# Altium project StepperController.PrjPcb
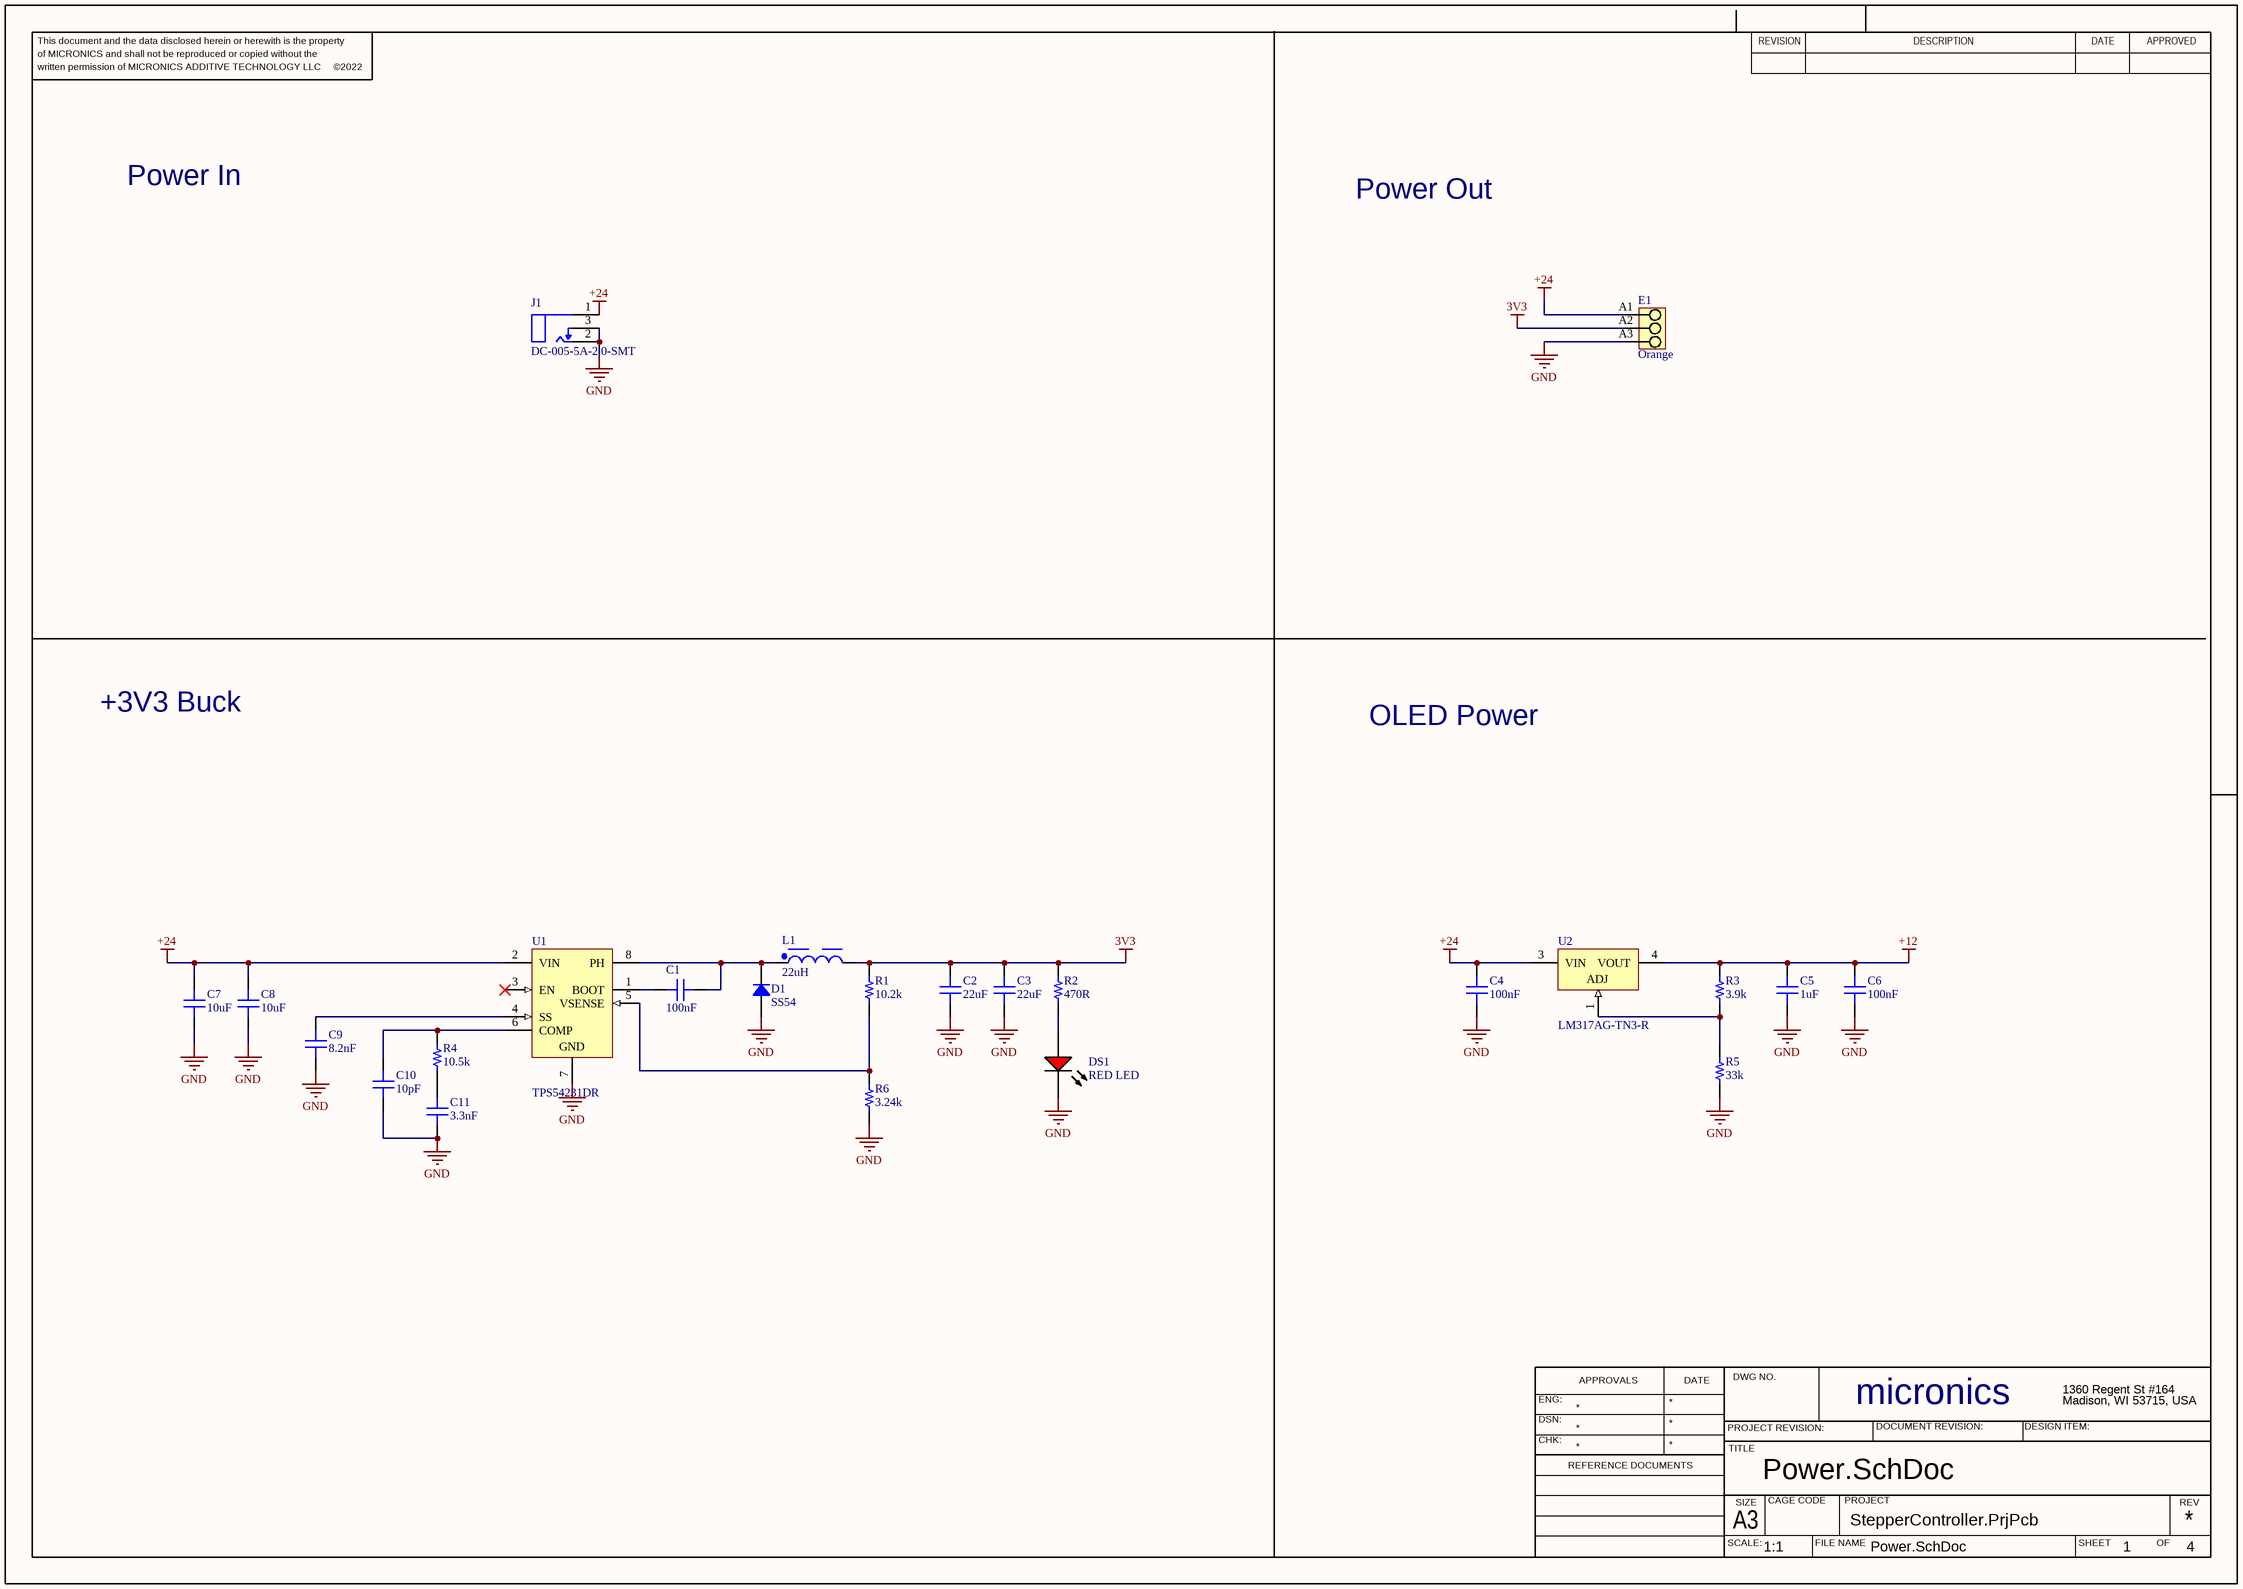
[diagram p0: Power.SchDoc]
4 sheets, 108 parts. Net scope: flat (ports and power ports of the same name join across sheets).
Board file: StepperController_PCB.PcbDoc
Sheets:
  Power.SchDoc
  ESP32.SchDoc
  Stepper.SchDoc
  Buttons.SchDoc

## Sheet Power.SchDoc
size 420 x 297 mm; SheetNumber: 1; SheetTotal: 4

### Parts
C1  100nF  [CAP 0603_1608]
C2  22uF  [CAP 1206_3216 - 0.8MM]
C3  22uF  [CAP 1206_3216 - 0.8MM]
C4  100nF  [CAP 0603_1608]
C5  1uF  [CAP 0603_1608]
C6  100nF  [CAP 0603_1608]
C7  10uF  [CAP 1206_3216 - 0.8MM]
C8  10uF  [CAP 1206_3216 - 0.8MM]
C9  8.2nF  [CAP 0603_1608]
C10  10pF  [CAP 0603_1608]
C11  3.3nF  [CAP 0603_1608]
D1  SS54  [DO214AC SMA]
DS1  RED LED  [VISH-TLMS1000_V]
E1  Orange  [PM_5_08_90_03]
J1  DC-005-5A-2.0-SMT  [FP-PJ-002BH-SMT-TR-MFG]
L1  22uH  [WE-PD_1050P]
R1  10.2k  [RES 0603_1608]
R2  470R  [RES 0603_1608]
R3  3.9k  [RES 0603_1608]
R4  10.5k  [RES 0603_1608]
R5  33k  [RES 0603_1608]
R6  3.24k  [RES 0603_1608]
U1  TPS54231DR  [D0008A_L]
U2  LM317AG-TN3-R  [TO-252_L]

### Nets
3V3: C2.2 C3.2 E1.A2 L1.2 R1.2 R2.2
+12: C5.1 C6.1 R3.2 U2.4(VOUT)
+24: C4.1 C7.2 C8.2 E1.A1 J1.1 U1.2(VIN) U2.3(VIN)
GND: C2.1 C3.1 C4.2 C5.2 C6.2 C7.1 C8.1 C9.1 C10.1 C11.1 D1.1 DS1.2(K) E1.A3 J1.2 J1.3 R5.1 R6.1 U1.7(GND)
NetC1_1: C1.1 D1.2 L1.1 U1.8(PH)
NetC1_2: C1.2 U1.1(BOOT)
NetC9_2: C9.2 U1.4(SS)
NetC10_2: C10.2 R4.2 U1.6(COMP)
NetC11_2: C11.2 R4.1
NetDS1_1: DS1.1(A) R2.1
NetR1_1: R1.1 R6.2 U1.5(VSENSE)
NetR3_1: R3.1 R5.2 U2.1(ADJ)

Not connected (* = marked no-connect by the designer): U1 3(EN)*

### Notes on the sheet
- Power In
- Power Out
- +3V3 Buck
- OLED Power
- This document and the data disclosed herein or herewith is the property
- of MICRONICS and shall not be reproduced or copied without the
- REVISION
- DESCRIPTION
- DATE
- APPROVED
- written permission of MICRONICS ADDITIVE TECHNOLOGY LLC     ©2022
- ENG:
- APPROVALS
- DWG NO.
- micronics
- 1360 Regent St #164
- Madison, WI 53715, USA
- DSN:
- CHK:
- REFERENCE DOCUMENTS
- PROJECT REVISION:
- TITLE
- DOCUMENT REVISION:
- DESIGN ITEM:
- SCALE:
- A3
- SIZE
- CAGE CODE
- FILE NAME
- PROJECT
- SHEET
- OF
- REV
- 1:1

### Library data of the parts
C1 = 250X14W223MV4T: C14663; manufacturer: Johanson Dielectrics Inc.; Temperature Coefficient: X7R; Tolerance: ±20%; Voltage - Rated: 25V; Part Number: 250X14W223MV4T; Value: 100nF; Applications: Bypass, Decoupling; Capacitance: 100nF; componentlink1description: Datasheet; componentlink1url: https://www.johansondielectrics.com/downloads/x2y-filter-and-decoupling-capacitors.pdf; componentlink2description: DigiKey Link; componentlink2url: https://www.digikey.com/en/products/detail/johanson-dielectrics-inc/250X14W223MV4T/1628740; Device Package: 0603 (1608 Metric); Features: Low ESL (X2Y); lastupdated: 2022-05-16 11:25:57 AM; Lifecycle Status: Active; Minimum Order: 1; Mounting Type: Surface Mount, MLCC; Operating Temperature: -55°C ~ 125°C; Package / Case: 0603 (1608 Metric); packaging: TapeAndReel; partid: 14325; Part Status: Active; price: 0.07; series: X2Y®; Size / Dimension: 0.064" L x 0.035" W (1.63mm x 0.89mm); Supplier 1: DigiKey; Supplier Part Number 1: 709-1087-1-ND; Thickness (Max): 0.026" (0.66mm)
C2 C3 = MM061A101JCT2A: C12891; manufacturer: AVX Corporation; Temperature Coefficient: C0G, NP0; Tolerance: ±5%; Voltage - Rated: 100V; Part Number: MM061A101JCT2A; Value: 22uF; Applications: Medical, Non-Critical; Capacitance: 22uF; componentlink1description: Datasheet; componentlink1url: http://datasheets.avx.com/AVX-MM.pdf; componentlink2description: DigiKey Link; componentlink2url: http://digikey.com/product-detail/en/avx-corporation/MM061A101JCT2A/478-10622-1-ND/7344883; Device Package: 1206 (3216 Metric); lastupdated: 2020-09-02 1:04:46 AM; Lifecycle Status: Active; Minimum Order: 1; Mounting Type: Surface Mount, MLCC; Operating Temperature: -55°C ~ 125°C; Package / Case: 1206 (3216 Metric); packaging: TapeAndReel; partid: 18685; Part Status: Active; price: 0.52; series: MM; Size / Dimension: 0.126" L x 0.063" W (3.20mm x 1.60mm); Supplier 1: DigiKey; Supplier Part Number 1: 478-10622-1-ND; Thickness (Max): 0.029" (0.74mm)
C4-C6 = 250X14W223MV4T: CAP CER 0.022UF 25V X7R 0603; manufacturer: Johanson Dielectrics Inc.; Tolerance: ±20%; Part Number: 250X14W223MV4T; Applications: Bypass, Decoupling; componentlink1description: Datasheet; componentlink1url: https://www.johansondielectrics.com/downloads/x2y-filter-and-decoupling-capacitors.pdf; componentlink2description: DigiKey Link; componentlink2url: https://www.digikey.com/en/products/detail/johanson-dielectrics-inc/250X14W223MV4T/1628740; Device Package: 0603 (1608 Metric); Features: Low ESL (X2Y); lastupdated: 2022-05-20 2:39:33 PM; Lifecycle Status: Active; Minimum Order: 1; Mounting Type: Surface Mount, MLCC; Operating Temperature: -55°C ~ 125°C; Package / Case: 0603 (1608 Metric); packaging: TapeAndReel; partid: 14325; Part Status: Active; price: 0.07; series: X2Y®; Size / Dimension: 0.064" L x 0.035" W (1.63mm x 0.89mm); Supplier 1: DigiKey; Supplier Part Number 1: 709-1087-1-ND; Temperature Coefficient: X7R; Thickness (Max): 0.026" (0.66mm); Voltage - Rated: 25V
  C4 C6: Value: 100nF; Capacitance: 100nF
  C5: Value: 1uF; Capacitance: 1uF
C7 C8 = MM061A101JCT2A: C13585; manufacturer: AVX Corporation; Temperature Coefficient: C0G, NP0; Tolerance: ±5%; Voltage - Rated: 100V; Part Number: MM061A101JCT2A; Value: 10uF; Applications: Medical, Non-Critical; Capacitance: 10uF; componentlink1description: Datasheet; componentlink1url: http://datasheets.avx.com/AVX-MM.pdf; componentlink2description: DigiKey Link; componentlink2url: http://digikey.com/product-detail/en/avx-corporation/MM061A101JCT2A/478-10622-1-ND/7344883; Device Package: 1206 (3216 Metric); lastupdated: 2020-09-02 1:04:46 AM; Lifecycle Status: Active; Minimum Order: 1; Mounting Type: Surface Mount, MLCC; Operating Temperature: -55°C ~ 125°C; Package / Case: 1206 (3216 Metric); packaging: TapeAndReel; partid: 18685; Part Status: Active; price: 0.52; series: MM; Size / Dimension: 0.126" L x 0.063" W (3.20mm x 1.60mm); Supplier 1: DigiKey; Supplier Part Number 1: 478-10622-1-ND; Thickness (Max): 0.029" (0.74mm)
C9-C11 = 250X14W223MV4T: manufacturer: Johanson Dielectrics Inc.; Temperature Coefficient: X7R; Tolerance: ±20%; Voltage - Rated: 25V; Part Number: 250X14W223MV4T; Applications: Bypass, Decoupling; componentlink1description: Datasheet; componentlink1url: https://www.johansondielectrics.com/downloads/x2y-filter-and-decoupling-capacitors.pdf; componentlink2description: DigiKey Link; componentlink2url: https://www.digikey.com/en/products/detail/johanson-dielectrics-inc/250X14W223MV4T/1628740; Device Package: 0603 (1608 Metric); Features: Low ESL (X2Y); lastupdated: 2022-05-16 11:25:57 AM; Lifecycle Status: Active; Minimum Order: 1; Mounting Type: Surface Mount, MLCC; Operating Temperature: -55°C ~ 125°C; Package / Case: 0603 (1608 Metric); packaging: TapeAndReel; partid: 14325; Part Status: Active; price: 0.07; series: X2Y®; Size / Dimension: 0.064" L x 0.035" W (1.63mm x 0.89mm); Supplier 1: DigiKey; Supplier Part Number 1: 709-1087-1-ND; Thickness (Max): 0.026" (0.66mm)
  C9: Value: 8.2nF; Capacitance: 8.2nF
  C10: Value: 10pF; Capacitance: 10pF
  C11: Value: 3.3nF; Capacitance: 3.3nF
D1 = RS1A: Manufacturer: ON Semiconductor; Capacitance @ Vr, F: 10pF @ 4V, 1MHz; Current - Average Rectified (Io): 1A; Current - Reverse Leakage @ Vr: 5µA @ 50V; Diode Type: Standard; Reverse Recovery Time (trr): 150ns; Speed: Fast Recovery =< 500ns, > 200mA (Io); Voltage - DC Reverse (Vr) (Max): 50V; Voltage - Forward (Vf) (Max) @ If: 1.3V @ 1A; Part Number: SS54; ComponentLink1Description: Datasheet; ComponentLink1URL: https://www.onsemi.com/pub/Collateral/RS1M-D.PDF; ComponentLink2Description: DigiKey Link; ComponentLink2URL: http://digikey.com/product-detail/en/on-semiconductor/RS1A/RS1ACT-ND/3504478; LastUpdated: 2022-05-20 3:23:52 PM; Lifecycle Status: Active; Minimum Order: 1; Mounting Type: Surface Mount; Operating Temperature - Junction: -55°C ~ 150°C; Package / Case: DO-214AC, SMA; Packaging: TapeAndReel; PartId: 585; Part Status: Active; Price: 0.08; Series: -; Supplier 1: DigiKey; Supplier Part Number 1: RS1ACT-ND; Supplier Device Package: SMA (DO-214AC)
DS1 = CMP-2000-07254-1: 0603 LED; Manufacturer: Vishay; Lens Shape: Rectangular; LED Mounting: SMD; Automotive Qualification Standard: AEC-Q100; Wavelength Typ: 636nm; SVHC: ToBeAdvised; Bulb Size: 1.6mmx0.8mm; Forward Voltage: 1.8V; Luminous Intensity: 4mcd; Forward Current If: 2mA; Viewing Angle: 80°; Datasheet Version: Rev. 1.7, 02/2011; Datasheet URL: https://datasheet.ciiva.com/5798/1698881-5798337.pdf; Packaging: CutTape; Package Reference: TLMS1000; Manufacturer URL: http://www.vishay.com/; Mounting Technology: SurfaceMount; Product Range: -; LED Colour: Red; Package Description: 2-Pin Surface Mount Device, Body 1.6 x 0.8 mm; MSL: MSL2-1year
E1 = CMP-1559-01629-1: C430604; PartNumber: 1760500000; Manufacturer: Weidmueller; Pitch_mm: 5,08 mm; Pitch_inch: 0,2 inch; Wire_cross_section_AWG_min_UL_1059: AWG 26; Contact_surface: tinned; Contact_material: Cu-Leg; Short_text_for_material: PM 5.08/03/90 3.5SN OR BX; Rated_voltage_use_group_B_UL_1059: 300 V; Solid_min_H05_07_V_U: 0,13 mm²; Solder_pin_length_mm: 3,5 mm; Rated_voltage_for_surge_voltage_class_pollution_degree_II_2: 600 V; Mounting_onto_the_PCB: Solder connection; Solid_max_H05_07_V_U: 2,5 mm²; Side_termination_characteristic: closed side; Rated_current_use_group_B_UL_1059: 15 A; Wire_cross_section_AWG_max_UL_1059: AWG 14; Insulating_material: Wemid (PA); UL_94_flammability_rating: V-0; No_of_poles: 3; ComponentLink2Description: URL Link1; ComponentLink1Description: Manufacturer URL; ComponentLink2URL: http://catalog.weidmueller.com/catalog/Start.do?localeId=en&ObjectID=1760500000; ComponentLink1URL: http://www.weidmueller.com/; Qty: 500 PCS; Colour: Orange; Packaging: Box; Revision: V1; PackageReference: PM_5_08_90_03
J1 = CMP-2000-06897-2: C319134; Manufacturer: CUI Inc; Manufacturer Part Number: PJ-002BH-SMT-TR; Current Rating: 5A; Standoff Height: 0.1mm; Voltage Rating: 24V; Conn Gender: Male; Conn Orientation: Right Angle; Number Of Contacts: 3; Temperature Range Low: -25°C; Category: Conn; Package: 0; Device Class L2: Power Connectors; Contact Material: Nickel,Silver; Automotive: No; Mouser Description: 2.5 mm Center Pin, 5.0 A, Right Angle, Surface Mount (SMT), Dc Power Jack Connector; Device Class L3: unset; ComponentLink2URL: https://www.cuidevices.com/product/resource/digikeypdf/pj-002bh-smt-tr.pdf; Octopart: https://octopart.com/pj-002bh-smt-tr-cui-25947151; Lead Free: Yes; ComponentLink2Description: Datasheet; Digikey Description: CONN PWR JACK 2.5X5.5MM SOLDER; Height: 11.43mm; Temperature: -25°C to +85°C; RoHS: TRUE; Device Class L1: Connectors; Temperature Range High: +85°C
L1 = CMP-1396-00034-2: C2651173; NexarPartId: 22866943; Test Frequency: 100kHz; Inductance Tolerance: 20%; Inductance: 22µH; Core Material: Ferrite; Resistance: 50mΩ; DC Resistance (DCR): 42mΩ; Self Resonant Frequency: 14.5MHz; Max DC Current: 3A; Shielding: Shielded; Saturation Current: 3.6A; Min Operating Temperature: -40°C; Max Operating Temperature: 150°C; Case/Package: Nonstandard; Length: 10mm; Width: 10mm; Termination: SMD/SMT; Series Resistance: 50mΩ; Height: 5mm; Ambient Temperature Range Low: -40°C; RMS Current (Irms): 3A; Composition: Wirewound; Tolerance: 20%; REACH SVHC: Unknown; Depth: 10mm; Packaging: Tape & Reel (TR); Mount: Surface Mount; Height - Seated (Max): 5.0038mm; RoHS: Compliant; Number of Pins: 2; Ambient Temperature Range High: 110°C; Current Rating: 3A
R1-R6 = RNCF0603DTE23K2: RES 23.2K OHM 0.5% 1/10W 0603; Manufacturer: Stackpole Electronics Inc; Power (Watts): 0.1W, 1/10W; Temperature Coefficient: ±25ppm/°C; Part Number: RNCF0603DTE23K2; ComponentLink1Description: Datasheet; ComponentLink1URL: https://www.seielect.com/catalog/sei-rncf.pdf; ComponentLink2Description: DigiKey Link; ComponentLink2URL: https://www.digikey.com/en/products/detail/stackpole-electronics-inc/RNCF0603DTE23K2/6264115; Composition: Thin Film; Device Package: 0603 (1608 Metric); Features: Automotive AEC-Q200; Height - Seated (Max): 0.022" (0.55mm); LastUpdated: 2022-05-20 3:01:33 PM; Lifecycle Status: Active; Minimum Order: 1; Number of Terminations: 2; Operating Temperature: -55°C ~ 155°C; Package / Case: 0603 (1608 Metric); Packaging: TapeAndReel; PartId: 5426; Part Status: Active; Price: 0.01; Ratings: AEC-Q200; Series: RNCF; Size / Dimension: 0.061" L x 0.031" W (1.55mm x 0.80mm); Supplier 1: DigiKey; Supplier Part Number 1: RNCF0603DTE23K2CT-ND; Supplier Device Package: 0603; Tolerance: ±0.5%
  R1: Value: 10.2k; Resistance: 10.2k
  R2: Value: 470R; Resistance: 470R
  R3: Value: 3.9k; Resistance: 3.9k
  R4: Value: 10.5k; Resistance: 10.5k
  R5: Value: 33k; Resistance: 33k
  R6: Value: 3.24k; Resistance: 3.24k
U1 = CMP-0323-00207-3: Buck Step Down Regulator with 3.5 to 28 V Input and 0.8 to 25 V Output, -40 to 150 degC, 8-Pin SOIC (D), Green (RoHS & no Sb/Br); Manufacturer: Texas Instruments; Vout(Min)(V): 0.8; Iout(Max)(A): 2; SubFamily: Step-Down Regulator; Vin(Min)(V): 3.5; Rating: Catalog; Duty Cycle(Max)(%): 90; Switch Current Limit(Typ)(A): 2.3; Iq(Typ)(mA): 0.11; Regulated Outputs(#): 1; Vout(Max)(V): 25; Vin(Max)(V): 28; ComponentLink2Description: Package Specification; PackageVersion: revM, Jun-2011; Topology: Buck; PackageReference: D0008A; DatasheetVersion: SLUS851C; Code_JEDEC: MS-012AA; PartNumber: TPS54231DR; ComponentLink2URL: http://www.ti.com/litv/pdf/msoi002j; Eco-Plan: Green (RoHS & no Sb/Br); ComponentLink1URL: http://www.ti.com/general/docs/lit/getliterature.tsp?genericPartNumber=TPS54231&fileType=pdf; ComponentLink1Description: Datasheet; PackageDescription: 8-Pin Plastic Small Outline Integrated Circuit, 4.9 x 3.9 mm, Pitch 1.27 mm Pitch; ComponentLink3URL: Samples URL:http://www.ti.com/product/tps54231#samples; Mounting Technology: Surface Mount; ComponentLink3Description: URL Link1
U2 = CMP-0244-00074-1: C75510; DatasheetVersion: 1/02/2008; ComponentLink1Description: Manufacturer URL; PackageReference: TO-252; ComponentLink2Description: Datasheet; PackageDescription: 3-Pin Transistor Outline Package 2.28 mm Pitch, 9.7 mm Lead Span (DPAK); ComponentLink2URL: http://www.st.com/internet/com/TECHNICAL_RESOURCES/TECHNICAL_LITERATURE/DATASHEET/CD00000549.pdf; PackageVersion: 2011; ComponentLink1URL: http://www.st.com

## Sheet ESP32.SchDoc
size 420 x 297 mm; SheetNumber: 2; SheetTotal: 4
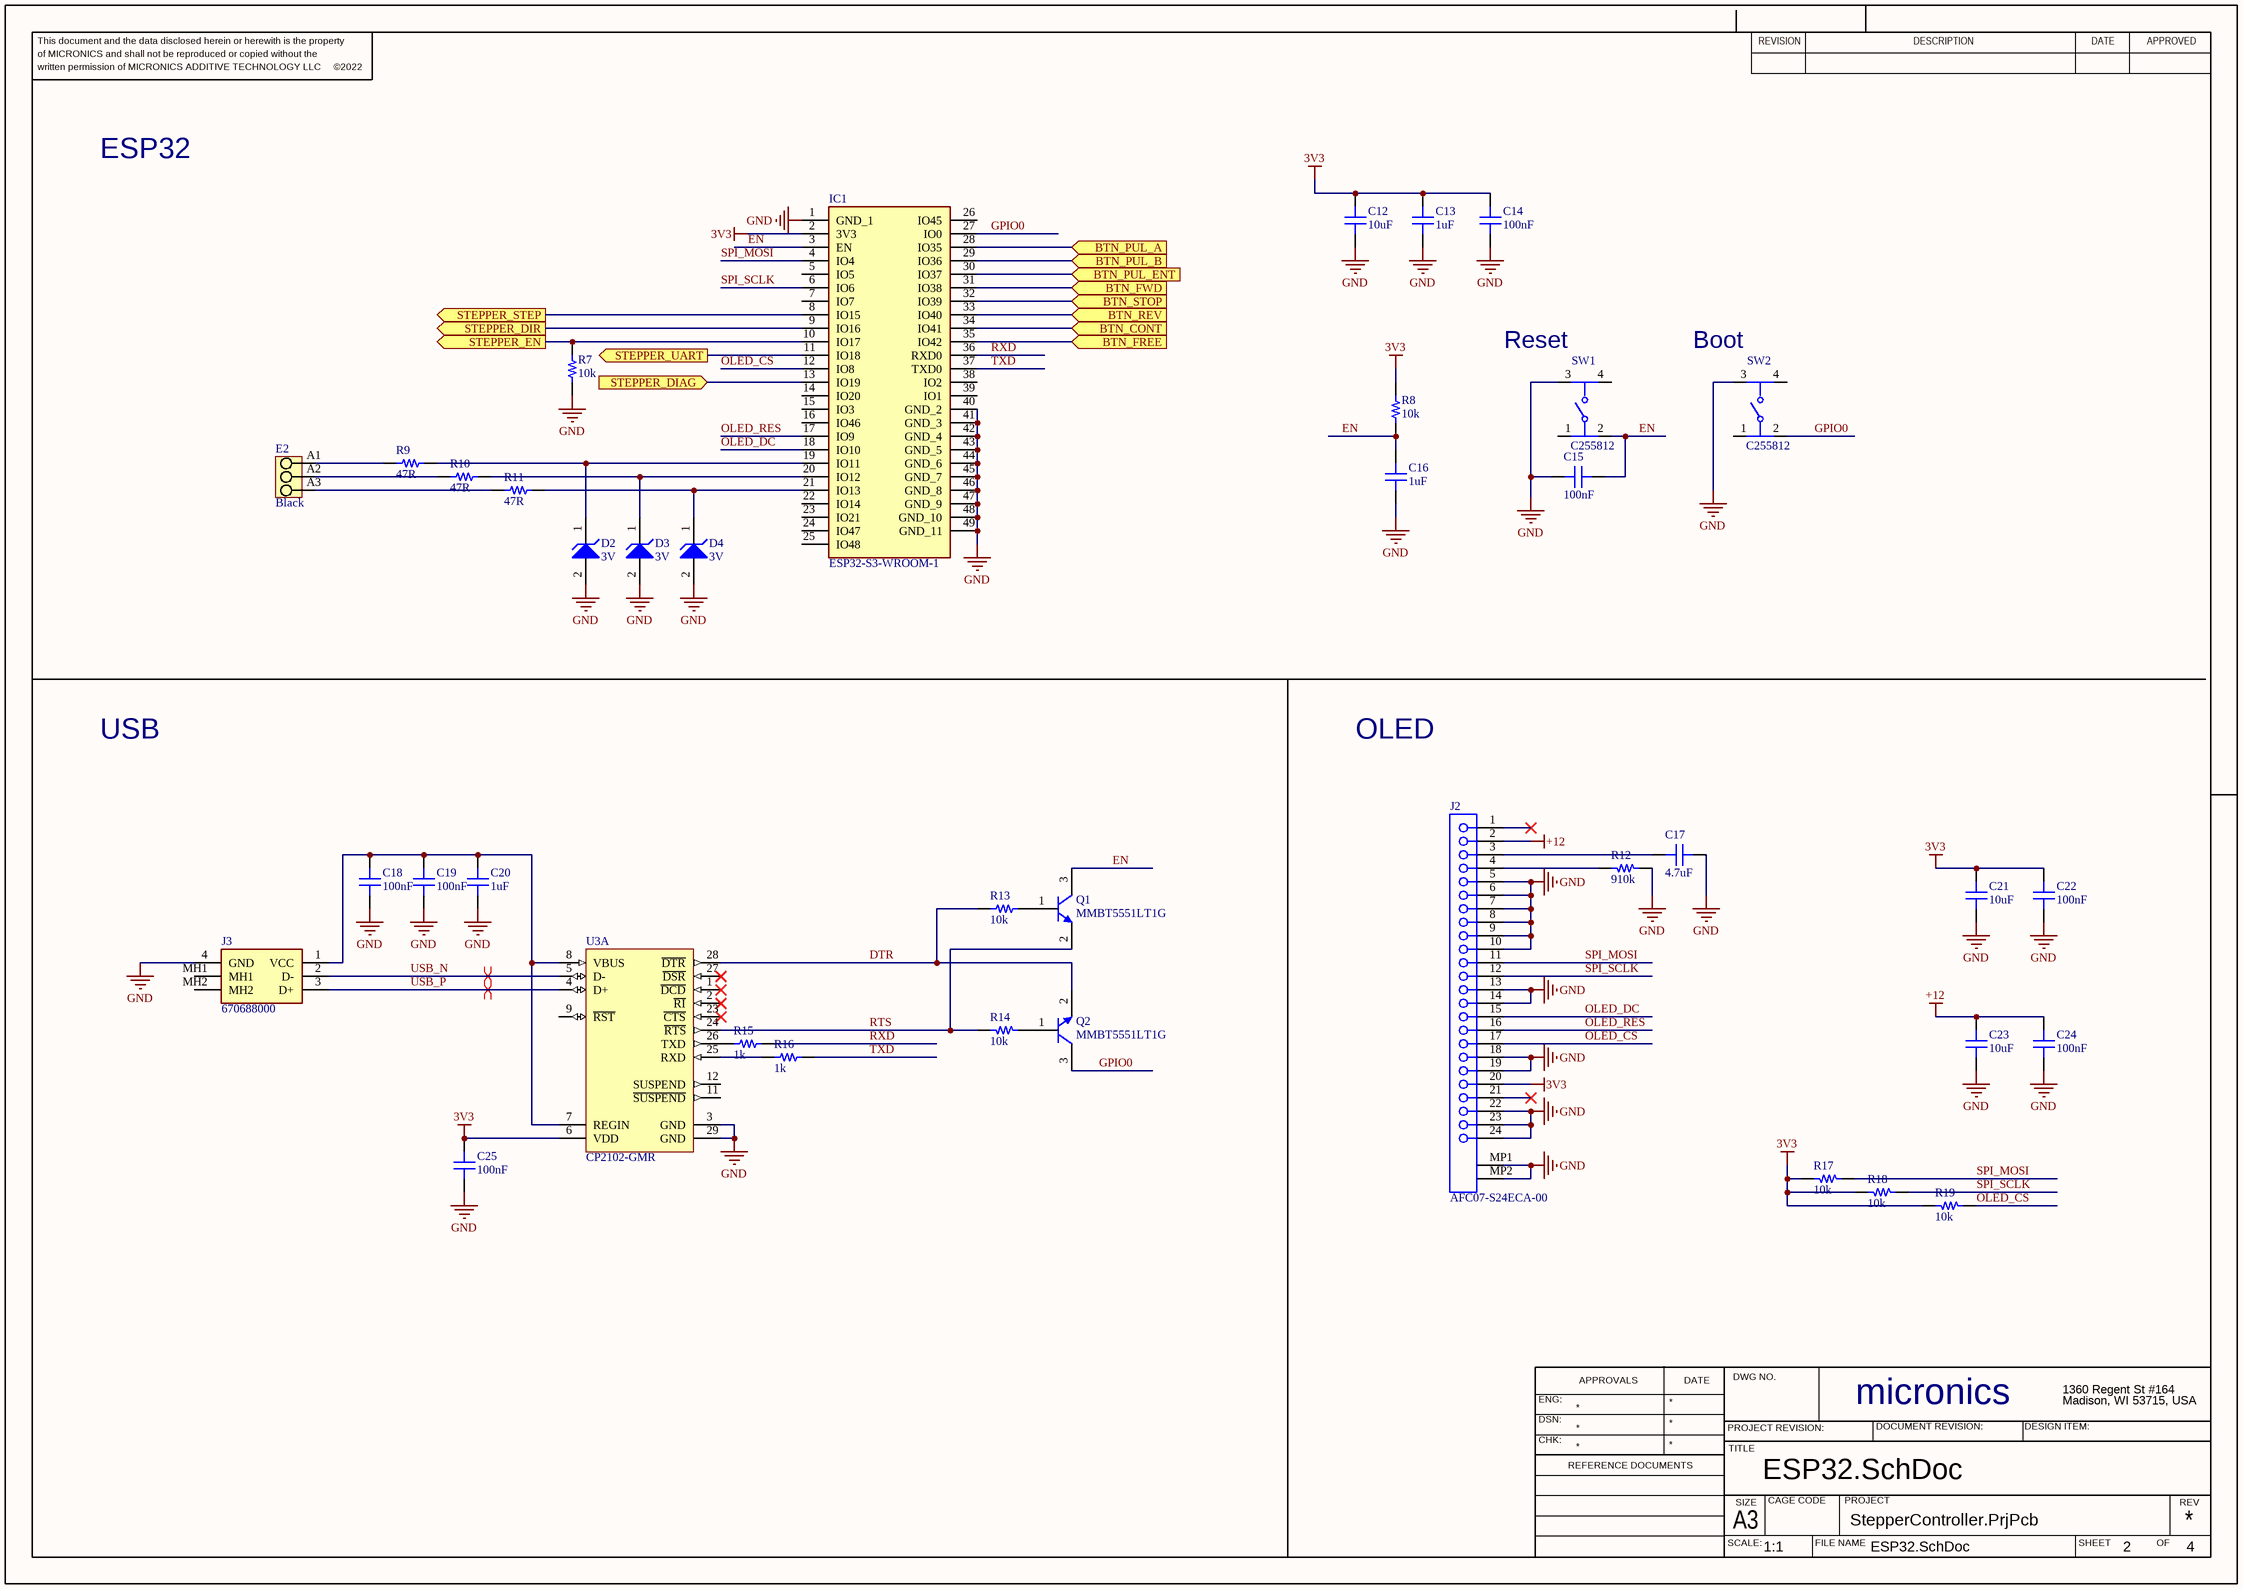
[diagram p1: ESP32.SchDoc]

### Parts
C12  10uF  [CAP 1206_3216 - 0.8MM]
C13  1uF  [CAP 0603_1608]
C14  100nF  [CAP 0603_1608]
C15  100nF  [CAP 0603_1608]
C16  1uF  [CAP 0603_1608]
C17  4.7uF  [CAP 1206_3216 - 0.8MM]
C18  100nF  [CAP 0603_1608]
C19  100nF  [CAP 0603_1608]
C20  1uF  [CAP 0603_1608]
C21  10uF  [CAP 1206_3216 - 0.8MM]
C22  100nF  [CAP 0603_1608]
C23  10uF  [CAP 1206_3216 - 0.8MM]
C24  100nF  [CAP 0603_1608]
C25  100nF  [CAP 0603_1608]
D2  3V  [ONSC-SOD-123-2-425-04_V]
D3  3V  [ONSC-SOD-123-2-425-04_V]
D4  3V  [ONSC-SOD-123-2-425-04_V]
E2  Black  [PM_5_08_90_03]
IC1  ESP32-S3-WROOM-1  [ESP32S3WROOM1]
J2  AFC07-S24ECA-00  [MOLX-52437-2471]
J3  670688000  [670688000]
Q1  MMBT5551LT1G  [ONSC-SOT-23-3-318-08_V]
Q2  MMBT5551LT1G  [ONSC-SOT-23-3-318-08_V]
R7  10k  [RES 0603_1608]
R8  10k  [RES 0603_1608]
R9  47R  [RES 0603_1608]
R10  47R  [RES 0603_1608]
R11  47R  [RES 0603_1608]
R12  910k  [RES 0603_1608]
R13  10k  [RES 0603_1608]
R14  10k  [RES 0603_1608]
R15  1k  [RES 0603_1608]
R16  1k  [RES 0603_1608]
R17  10k  [RES 0603_1608]
R18  10k  [RES 0603_1608]
R19  10k  [RES 0603_1608]
SW1  C255812  [FP-FSM2JSMAA-MFG]
SW2  C255812  [FP-FSM2JSMAA-MFG]
U3  CP2102-GMR  [SLAB-QFN-28-3125x3125TP_M]  (part A of 2)

### Ports
BTN_CONT (in, see Buttons[2C]), BTN_FREE (in, see Buttons[3C]), BTN_FWD (in, see Buttons[5A]), BTN_PUL_A (in, see Buttons[3A]), BTN_PUL_B (in, see Buttons[3B]), BTN_PUL_ENT (in, see Buttons[3B]), BTN_REV (in, see Buttons[5C]), BTN_STOP (in, see Buttons[5B]), STEPPER_DIAG (in), STEPPER_DIR (out, see Stepper[2B]), STEPPER_EN (out, see Stepper[2C]), STEPPER_STEP (out, see Stepper[2B]), STEPPER_UART (out)

### Nets
3V3: C12.2 C13.2 C14.1 C21.2 C22.1 C25.1 IC1.2(3V3) J2.20 R8.1 R17.2 R18.2 R19.2 U3.6(VDD)
+12: C23.2 C24.1 J2.2
GND: C12.1 C13.1 C14.2 C15.2 C16.1 C17.1 C18.2 C19.2 C20.1 C21.1 C22.2 C23.1 C24.2 C25.2 D2.2(A) D3.2(A) D4.2(A) IC1.1(GND_1) IC1.40(GND_2) IC1.41(GND_3) IC1.42(GND_4) IC1.43(GND_5) IC1.44(GND_6) IC1.45(GND_7) IC1.46(GND_8) IC1.47(GND_9) IC1.48(GND_10) IC1.49(GND_11) J2.5 J2.6 J2.7 J2.8 J2.9 J2.10 J2.13 J2.14 J2.18 J2.19 J2.22 J2.23 J2.24 J2.MP1 J2.MP2 J3.4(GND) R7.2 R12.2 SW1.3 SW2.3 U3.3(GND) U3.29(GND)
DTR: Q2.2(E) R13.1 U3.28(~{DTR})
EN: C15.1 C16.2 IC1.3(EN) Q1.3(C) R8.2 SW1.2
GPIO0: IC1.27(IO0) Q2.3(C) SW2.2
OLED_CS: IC1.12(IO8) J2.17 R19.1
OLED_DC: IC1.18(IO10) J2.15
OLED_RES: IC1.17(IO9) J2.16
RTS: Q1.2(E) R14.1 U3.24(~{RTS})
RXD: IC1.36(RXD0) R15.2
SPI_MOSI: IC1.4(IO4) J2.11 R17.1
SPI_SCLK: IC1.6(IO6) J2.12 R18.1
TXD: IC1.37(TXD0) R16.2
USB_N: J3.2(D-) U3.5(D-)
USB_P: J3.3(D+) U3.4(D+)
NetC17_2: C17.2 J2.3
NetC18_1: C18.1 C19.1 C20.2 J3.1(VCC) U3.7(REGIN) U3.8(VBUS)
NetC33_1: IC1.28(IO35) ; port BTN_PUL_A
NetC34_1: IC1.31(IO38) ; port BTN_FWD
NetC35_1: IC1.29(IO36) ; port BTN_PUL_B
NetC36_1: IC1.30(IO37) ; port BTN_PUL_ENT
NetC37_1: IC1.32(IO39) ; port BTN_STOP
NetC38_1: IC1.34(IO41) ; port BTN_CONT
NetC39_1: IC1.35(IO42) ; port BTN_FREE
NetC40_1: IC1.33(IO40) ; port BTN_REV
NetD2_1: D2.1(K) IC1.19(IO11) R9.2
NetD3_1: D3.1(K) IC1.20(IO12) R10.2
NetD4_1: D4.1(K) IC1.21(IO13) R11.2
NetE2_A1: E2.A1 R9.1
NetE2_A2: E2.A2 R10.1
NetE2_A3: E2.A3 R11.1
NetIC1_8: IC1.8(IO15) ; port STEPPER_STEP
NetIC1_9: IC1.9(IO16) ; port STEPPER_DIR
NetIC1_10: IC1.10(IO17) R7.1 ; port STEPPER_EN
NetIC1_11: IC1.11(IO18) ; port STEPPER_UART
NetIC1_13: IC1.13(IO19) ; port STEPPER_DIAG
NetJ2_4: J2.4 R12.1
NetQ1_1: Q1.1(B) R13.2
NetQ2_1: Q2.1(B) R14.2
NetR15_1: R15.1 U3.26(TXD)
NetR16_1: R16.1 U3.25(RXD)

Not connected (* = marked no-connect by the designer): IC1 5(IO5) 7(IO7) 14(IO20) 15(IO3) 16(IO46) 22(IO14) 23(IO21) 24(IO47) 25(IO48) 26(IO45) 38(IO2) 39(IO1); J2 1* 21*; J3 MH1 MH2; SW1 1 4; SW2 1 4; U3 1(~{DCD})* 2(~{RI})* 9(~{RST}) 11(~{SUSPEND}) 12(SUSPEND) 23(~{CTS})* 27(~{DSR})*

### Layout directives
differential pair; differential pair class USB: USB_N, USB_P

### Notes on the sheet
- ESP32
- (near SW1) Reset
- (near SW2) Boot
- USB
- OLED
- This document and the data disclosed herein or herewith is the property
- of MICRONICS and shall not be reproduced or copied without the
- REVISION
- DESCRIPTION
- DATE
- APPROVED
- written permission of MICRONICS ADDITIVE TECHNOLOGY LLC     ©2022
- ENG:
- APPROVALS
- DWG NO.
- micronics
- 1360 Regent St #164
- Madison, WI 53715, USA
- DSN:
- CHK:
- REFERENCE DOCUMENTS
- PROJECT REVISION:
- TITLE
- DOCUMENT REVISION:
- DESIGN ITEM:
- SCALE:
- A3
- SIZE
- CAGE CODE
- FILE NAME
- PROJECT
- SHEET
- OF
- REV
- 1:1

### Library data of the parts
C12 C21 C23 = MM061A101JCT2A: C89632; manufacturer: AVX Corporation; Temperature Coefficient: C0G, NP0; Tolerance: ±5%; Voltage - Rated: 100V; Part Number: MM061A101JCT2A; Value: 10uF; Applications: Medical, Non-Critical; Capacitance: 10uF; componentlink1description: Datasheet; componentlink1url: http://datasheets.avx.com/AVX-MM.pdf; componentlink2description: DigiKey Link; componentlink2url: http://digikey.com/product-detail/en/avx-corporation/MM061A101JCT2A/478-10622-1-ND/7344883; Device Package: 1206 (3216 Metric); lastupdated: 2020-09-02 1:04:46 AM; Lifecycle Status: Active; Minimum Order: 1; Mounting Type: Surface Mount, MLCC; Operating Temperature: -55°C ~ 125°C; Package / Case: 1206 (3216 Metric); packaging: TapeAndReel; partid: 18685; Part Status: Active; price: 0.52; series: MM; Size / Dimension: 0.126" L x 0.063" W (3.20mm x 1.60mm); Supplier 1: DigiKey; Supplier Part Number 1: 478-10622-1-ND; Thickness (Max): 0.029" (0.74mm)
C13 C16 C20 = 250X14W223MV4T: C15849; manufacturer: Johanson Dielectrics Inc.; Temperature Coefficient: X7R; Tolerance: ±20%; Voltage - Rated: 25V; Part Number: 250X14W223MV4T; Value: 1uF; Applications: Bypass, Decoupling; Capacitance: 1uF; componentlink1description: Datasheet; componentlink1url: https://www.johansondielectrics.com/downloads/x2y-filter-and-decoupling-capacitors.pdf; componentlink2description: DigiKey Link; componentlink2url: https://www.digikey.com/en/products/detail/johanson-dielectrics-inc/250X14W223MV4T/1628740; Device Package: 0603 (1608 Metric); Features: Low ESL (X2Y); lastupdated: 2022-05-16 11:25:57 AM; Lifecycle Status: Active; Minimum Order: 1; Mounting Type: Surface Mount, MLCC; Operating Temperature: -55°C ~ 125°C; Package / Case: 0603 (1608 Metric); packaging: TapeAndReel; partid: 14325; Part Status: Active; price: 0.07; series: X2Y®; Size / Dimension: 0.064" L x 0.035" W (1.63mm x 0.89mm); Supplier 1: DigiKey; Supplier Part Number 1: 709-1087-1-ND; Thickness (Max): 0.026" (0.66mm)
C14 C15 C18 C19 C22 C24 C25 = 250X14W223MV4T: as C1 on sheet Power; Part Number: 250X14W223MV4T; Value: 100nF; Applications: Bypass, Decoupling; Capacitance: 100nF; componentlink1description: Datasheet; componentlink1url: https://www.johansondielectrics.com/downloads/x2y-filter-and-decoupling-capacitors.pdf; componentlink2description: DigiKey Link; componentlink2url: https://www.digikey.com/en/products/detail/johanson-dielectrics-inc/250X14W223MV4T/1628740; Device Package: 0603 (1608 Metric); Features: Low ESL (X2Y); lastupdated: 2022-05-16 11:25:57 AM; Lifecycle Status: Active; Minimum Order: 1; Mounting Type: Surface Mount, MLCC; Operating Temperature: -55°C ~ 125°C; Package / Case: 0603 (1608 Metric); packaging: TapeAndReel; partid: 14325; Part Status: Active; price: 0.07; series: X2Y®; Size / Dimension: 0.064" L x 0.035" W (1.63mm x 0.89mm); Supplier 1: DigiKey; Supplier Part Number 1: 709-1087-1-ND; Thickness (Max): 0.026" (0.66mm)
C17 = MM061A101JCT2A: C29823; manufacturer: AVX Corporation; Temperature Coefficient: C0G, NP0; Tolerance: ±5%; Voltage - Rated: 100V; Part Number: MM061A101JCT2A; Value: 4.7uF; Applications: Medical, Non-Critical; Capacitance: 4.7uF; componentlink1description: Datasheet; componentlink1url: http://datasheets.avx.com/AVX-MM.pdf; componentlink2description: DigiKey Link; componentlink2url: http://digikey.com/product-detail/en/avx-corporation/MM061A101JCT2A/478-10622-1-ND/7344883; Device Package: 1206 (3216 Metric); lastupdated: 2020-09-02 1:04:46 AM; Lifecycle Status: Active; Minimum Order: 1; Mounting Type: Surface Mount, MLCC; Operating Temperature: -55°C ~ 125°C; Package / Case: 1206 (3216 Metric); packaging: TapeAndReel; partid: 18685; Part Status: Active; price: 0.52; series: MM; Size / Dimension: 0.126" L x 0.063" W (3.20mm x 1.60mm); Supplier 1: DigiKey; Supplier Part Number 1: 478-10622-1-ND; Thickness (Max): 0.029" (0.74mm)
D2-D4 = CMP-1060-00257-1: C12756; PartNumber: SZMMSZ12T3G; Manufacturer: On Semiconductor; P Max (W): 0.5; Packing: Tape and Reel; PackageDescription: 2-Pin SOD, Body 1.6 x 2.69 mm; RoHS: Pb-Free; PackageReference: SOD-123-2-425-04; ComponentLink1Description: Manufacturer URL; ComponentLink3URL: http://www.onsemi.com/pub_link/Collateral/425-04.PDF; Mounting Technology: Surface Mount; ComponentLink2URL: http://www.onsemi.com/pub_link/Collateral/MMSZ2V4T1-D.PDF; ComponentLink1URL: http://www.onsemi.com/; ComponentLink3Description: Package Specification; ComponentLink2Description: Datasheet; DatasheetVersion: Rev. 11; PackageVersion: Rev. G, 10/2009
E2 = CMP-1559-01629-1: C430602; PartNumber: 1760500000; Manufacturer: Weidmueller; Pitch_mm: 5,08 mm; Pitch_inch: 0,2 inch; Wire_cross_section_AWG_min_UL_1059: AWG 26; Contact_surface: tinned; Contact_material: Cu-Leg; Short_text_for_material: PM 5.08/03/90 3.5SN OR BX; Rated_voltage_use_group_B_UL_1059: 300 V; Solid_min_H05_07_V_U: 0,13 mm²; Solder_pin_length_mm: 3,5 mm; Rated_voltage_for_surge_voltage_class_pollution_degree_II_2: 600 V; Mounting_onto_the_PCB: Solder connection; Solid_max_H05_07_V_U: 2,5 mm²; Side_termination_characteristic: closed side; Rated_current_use_group_B_UL_1059: 15 A; Wire_cross_section_AWG_max_UL_1059: AWG 14; Insulating_material: Wemid (PA); UL_94_flammability_rating: V-0; No_of_poles: 3; ComponentLink2Description: URL Link1; ComponentLink1Description: Manufacturer URL; ComponentLink2URL: http://catalog.weidmueller.com/catalog/Start.do?localeId=en&ObjectID=1760500000; ComponentLink1URL: http://www.weidmueller.com/; Qty: 500 PCS; Colour: Orange; Packaging: Box; Revision: V1; PackageReference: PM_5_08_90_03
IC1 = ESP32-S3-WROOM-1: Integrated Circuit; Manufacturer_Name: Espressif Systems; Datasheet Link: https://www.mouser.com/catalog/specsheets/Espressif_ESP32_S3_WROOM_1_1U_Preliminary.pdf; Height: 3.25mm; Manufacturer_Part_Number: ESP32-S3-WROOM-1
J2 = CMP-1241-00285-1: C262643; PartNumber: 52437-2471; Manufacturer: Molex; Material - Metal: Phosphor Bronze; Material - Plating Mating: Gold; Durability (mating cycles max): 20; Stackable: No; Contact Position: Bottom; Entry Angle: 90degrees Angle; Circuits (Loaded): 24; Current (Max per Contact): 0.5A; PCB Retention: None; Packing: Tape and Reel; Pitch - Mating Interface: 0.50mm; Polarized to PCB: Yes; Voltage (Max): 50V; ComponentLink2URL: http://www.molex.com/webdocs/datasheets/pdf/en-us/0524372471_FFC_FPC_CONNECTORS.pdf; ComponentLink1URL: http://www.molex.com/molex/index.jsp; Mounting Technology: Surface Mount; RoHS: TRUE; ComponentLink3Description: Package Specification; ComponentLink2Description: Datasheet; PackageReference: 52437-2471; ComponentLink3URL: http://www.molex.com/pdm_docs/sd/524372471_sd.pdf; ComponentLink1Description: Manufacturer URL; PackageVersion: Rev. E, 07/2013; Number of Rows: 1; PCB Locator: No; PackageDescription: 24-Lead FPC Connector, Pitch 0.5 mm; Material - Plating Termination: Gold; Orientation: Right Angle
J3 = 67068-8000: Connector; Manufacturer_Name: Molex; Datasheet Link: https://www.molex.com/pdm_docs/sd/670688000_sd.pdf; Height: 11mm; Manufacturer_Part_Number: 67068-8000; Mouser Part Number: 538-67068-8000; Mouser Price/Stock: https://www.mouser.co.uk/ProductDetail/Molex/67068-8000?qs=N76qWb2E9MLsLGBiHvIzzg%3D%3D
Q1 Q2 = CMP-1048-00669-1: C41095; Manufacturer: On Semiconductor; IC Continuous (A): 0.6; Packing: Tape and Reel; Polarity: NPN; ComponentLink2URL: http://www.onsemi.cn/pub_link/Collateral/MMBT5550LT1-D.PDF; ComponentLink3Description: Package Specification; DatasheetVersion: Rev. 10; ComponentLink1URL: http://www.onsemi.com/; ComponentLink2Description: Datasheet; ComponentLink1Description: Manufacturer URL; PartNumber: MMBT5551LT1G; RoHS: TRUE; PackageReference: SOT-23-3-318-08; Mounting Technology: Surface Mount; PackageVersion: Rev. AP, 11/2009; ComponentLink3URL: http://www.onsemi.cn/pub_link/Collateral/318-08.PDF; PackageDescription: 3-Pin Small Outline Transistor, Body 2.92 x 1.3 mm, Pitch 0.95 mm
R7-R11 R13-R19 = RNCF0603DTE23K2: RES 1% 0603; Manufacturer: Stackpole Electronics Inc; Power (Watts): 0.1W, 1/10W; Temperature Coefficient: ±25ppm/°C; Tolerance: ±0.5%; Part Number: RNCF0603DTE23K2; ComponentLink1Description: Datasheet; ComponentLink1URL: https://www.seielect.com/catalog/sei-rncf.pdf; ComponentLink2Description: DigiKey Link; ComponentLink2URL: https://www.digikey.com/en/products/detail/stackpole-electronics-inc/RNCF0603DTE23K2/6264115; Composition: Thin Film; Device Package: 0603 (1608 Metric); Features: Automotive AEC-Q200; Height - Seated (Max): 0.022" (0.55mm); LastUpdated: 2022-05-20 3:01:33 PM; Lifecycle Status: Active; Minimum Order: 1; Number of Terminations: 2; Operating Temperature: -55°C ~ 155°C; Package / Case: 0603 (1608 Metric); Packaging: TapeAndReel; PartId: 5426; Part Status: Active; Price: 0.01; Ratings: AEC-Q200; Series: RNCF; Size / Dimension: 0.061" L x 0.031" W (1.55mm x 0.80mm); Supplier 1: DigiKey; Supplier Part Number 1: RNCF0603DTE23K2CT-ND; Supplier Device Package: 0603
  R7 R8 R13 R14 R17-R19: Value: 10k; Resistance: 10k
  R9-R11: Value: 47R; Resistance: 47R
  R15 R16: Value: 1k; Resistance: 1k
R12 = RNCS0603BKE10K0: RES 1% 0603; Manufacturer: Stackpole Electronics Inc; Power (Watts): 0.063W, 1/16W; Temperature Coefficient: ±25ppm/°C; Tolerance: ±0.1%; Part Number: RNCS0603BKE10K0; Value: 910k; ComponentLink1Description: Datasheet; ComponentLink1URL: https://www.seielect.com/catalog/sei-rncs_rnch.pdf; ComponentLink2Description: DigiKey Link; ComponentLink2URL: https://www.digikey.com/en/products/detail/stackpole-electronics-inc/RNCS0603BKE10K0/1708836; Composition: Thin Film; Device Package: 0603 (1608 Metric); Features: Anti-Corrosive, Automotive AEC-Q200, Moisture Resistant; Height - Seated (Max): 0.022" (0.55mm); LastUpdated: 2022-05-20 3:01:34 PM; Lifecycle Status: Active; Minimum Order: 1; Number of Terminations: 2; Operating Temperature: -55°C ~ 155°C; Package / Case: 0603 (1608 Metric); Packaging: TapeAndReel; PartId: 4838; Part Status: Active; Price: 0.08; Ratings: AEC-Q200; Resistance: 910k; Series: RNCS; Size / Dimension: 0.061" L x 0.031" W (1.55mm x 0.80mm); Supplier 1: DigiKey; Supplier Part Number 1: RNCS0603BKE10K0CT-ND; Supplier Device Package: 0603
SW1 SW2 = CMP-03402-000003-1: SWITCH TACTILE SPST-NO 0.05A 24V; Manufacturer Part Number: FSM2JSMAA; Manufacturer: TE Connectivity; Standoff Height: 0.05mm; Contact Current Rating: 50mA; Electromechanical Life: 100000Cycles; Operating Force: 260gf; Contact Resistance: 100mΩ; Package: 0; Temperature Range High: +85°C; Temperature: -35°C to +85°C; Category: Switch; RoHS: TRUE; Mouser Description: Tactile Switches TACTILE 260G FORCE S; Device Class L1: Electromechanical; Mount: Surface Mount; Height: 4.59mm; ComponentLink2URL: https://www.te.com/commerce/DocumentDelivery/DDEController?Action=showdoc&DocId=Customer+Drawing%7F2-1437565-7%7FV%7Fpdf%7FEnglish%7FENG_CD_2-1437565-7_V.pdf%7F2-1437565-8; Temperature Range Low: -35°C; Voltage Rating Dc: 24V; Lead Free: Yes; Automotive: No; Throw Configuration: SPST-NO; Octopart: https://octopart.com/fsm2jsmaa-te+connectivity-41720620; Device Class L2: Switches; Device Class L3: Pushbutton Switches; ComponentLink2Description: Datasheet; Digikey Description: SWITCH TACTILE SPST-NO 0.05A 24V
U3 = CMP-2000-04924-1: Single-Chip USB to URAT Bridge, 3.3 V, -40 to 85 degC, 28-Pin QFN, RoHS, Tape and Reel; Manufacturer: Silicon Labs; Interface Circuit Standard 1: RS-232; Transmitter and Receiver FIFO Counter: No; Supply Current: 26mA; Operating Supply Voltage (Min): 3V; Operating Supply Voltage (Typ): 3.3V; Data Rate: 1000kbps; Operating Supply Voltage (Max): 3.6V; Number of Channels: 1; Package URL: http://www.silabs.com/Support%20Documents/TechnicalDocs/C8051T61x.pdf; Operating Temperature (Max): 85C; Datasheet URL: http://www.mouser.com/ds/2/368/CP2102-9-247052.pdf; Operating Temperature Classification: Industrial; Operating Temperature (Min): -40C; Package Description: 28-Pin Quad-Flat No-Leads Package, Body 5 x 5 mm, Pitch 0.5 mm; Manufacturer URL: http://www.silabs.com/; Rad Hardened: No; Package Reference: QFN-28; Pin Count: 28; Packaging: TapeandReel; Mounting: SurfaceMount; Package Type: QFNEP; Datasheet Version: Rev. 1.6, 12/2013

## Sheet Stepper.SchDoc
size 420 x 297 mm; SheetNumber: 3; SheetTotal: 4
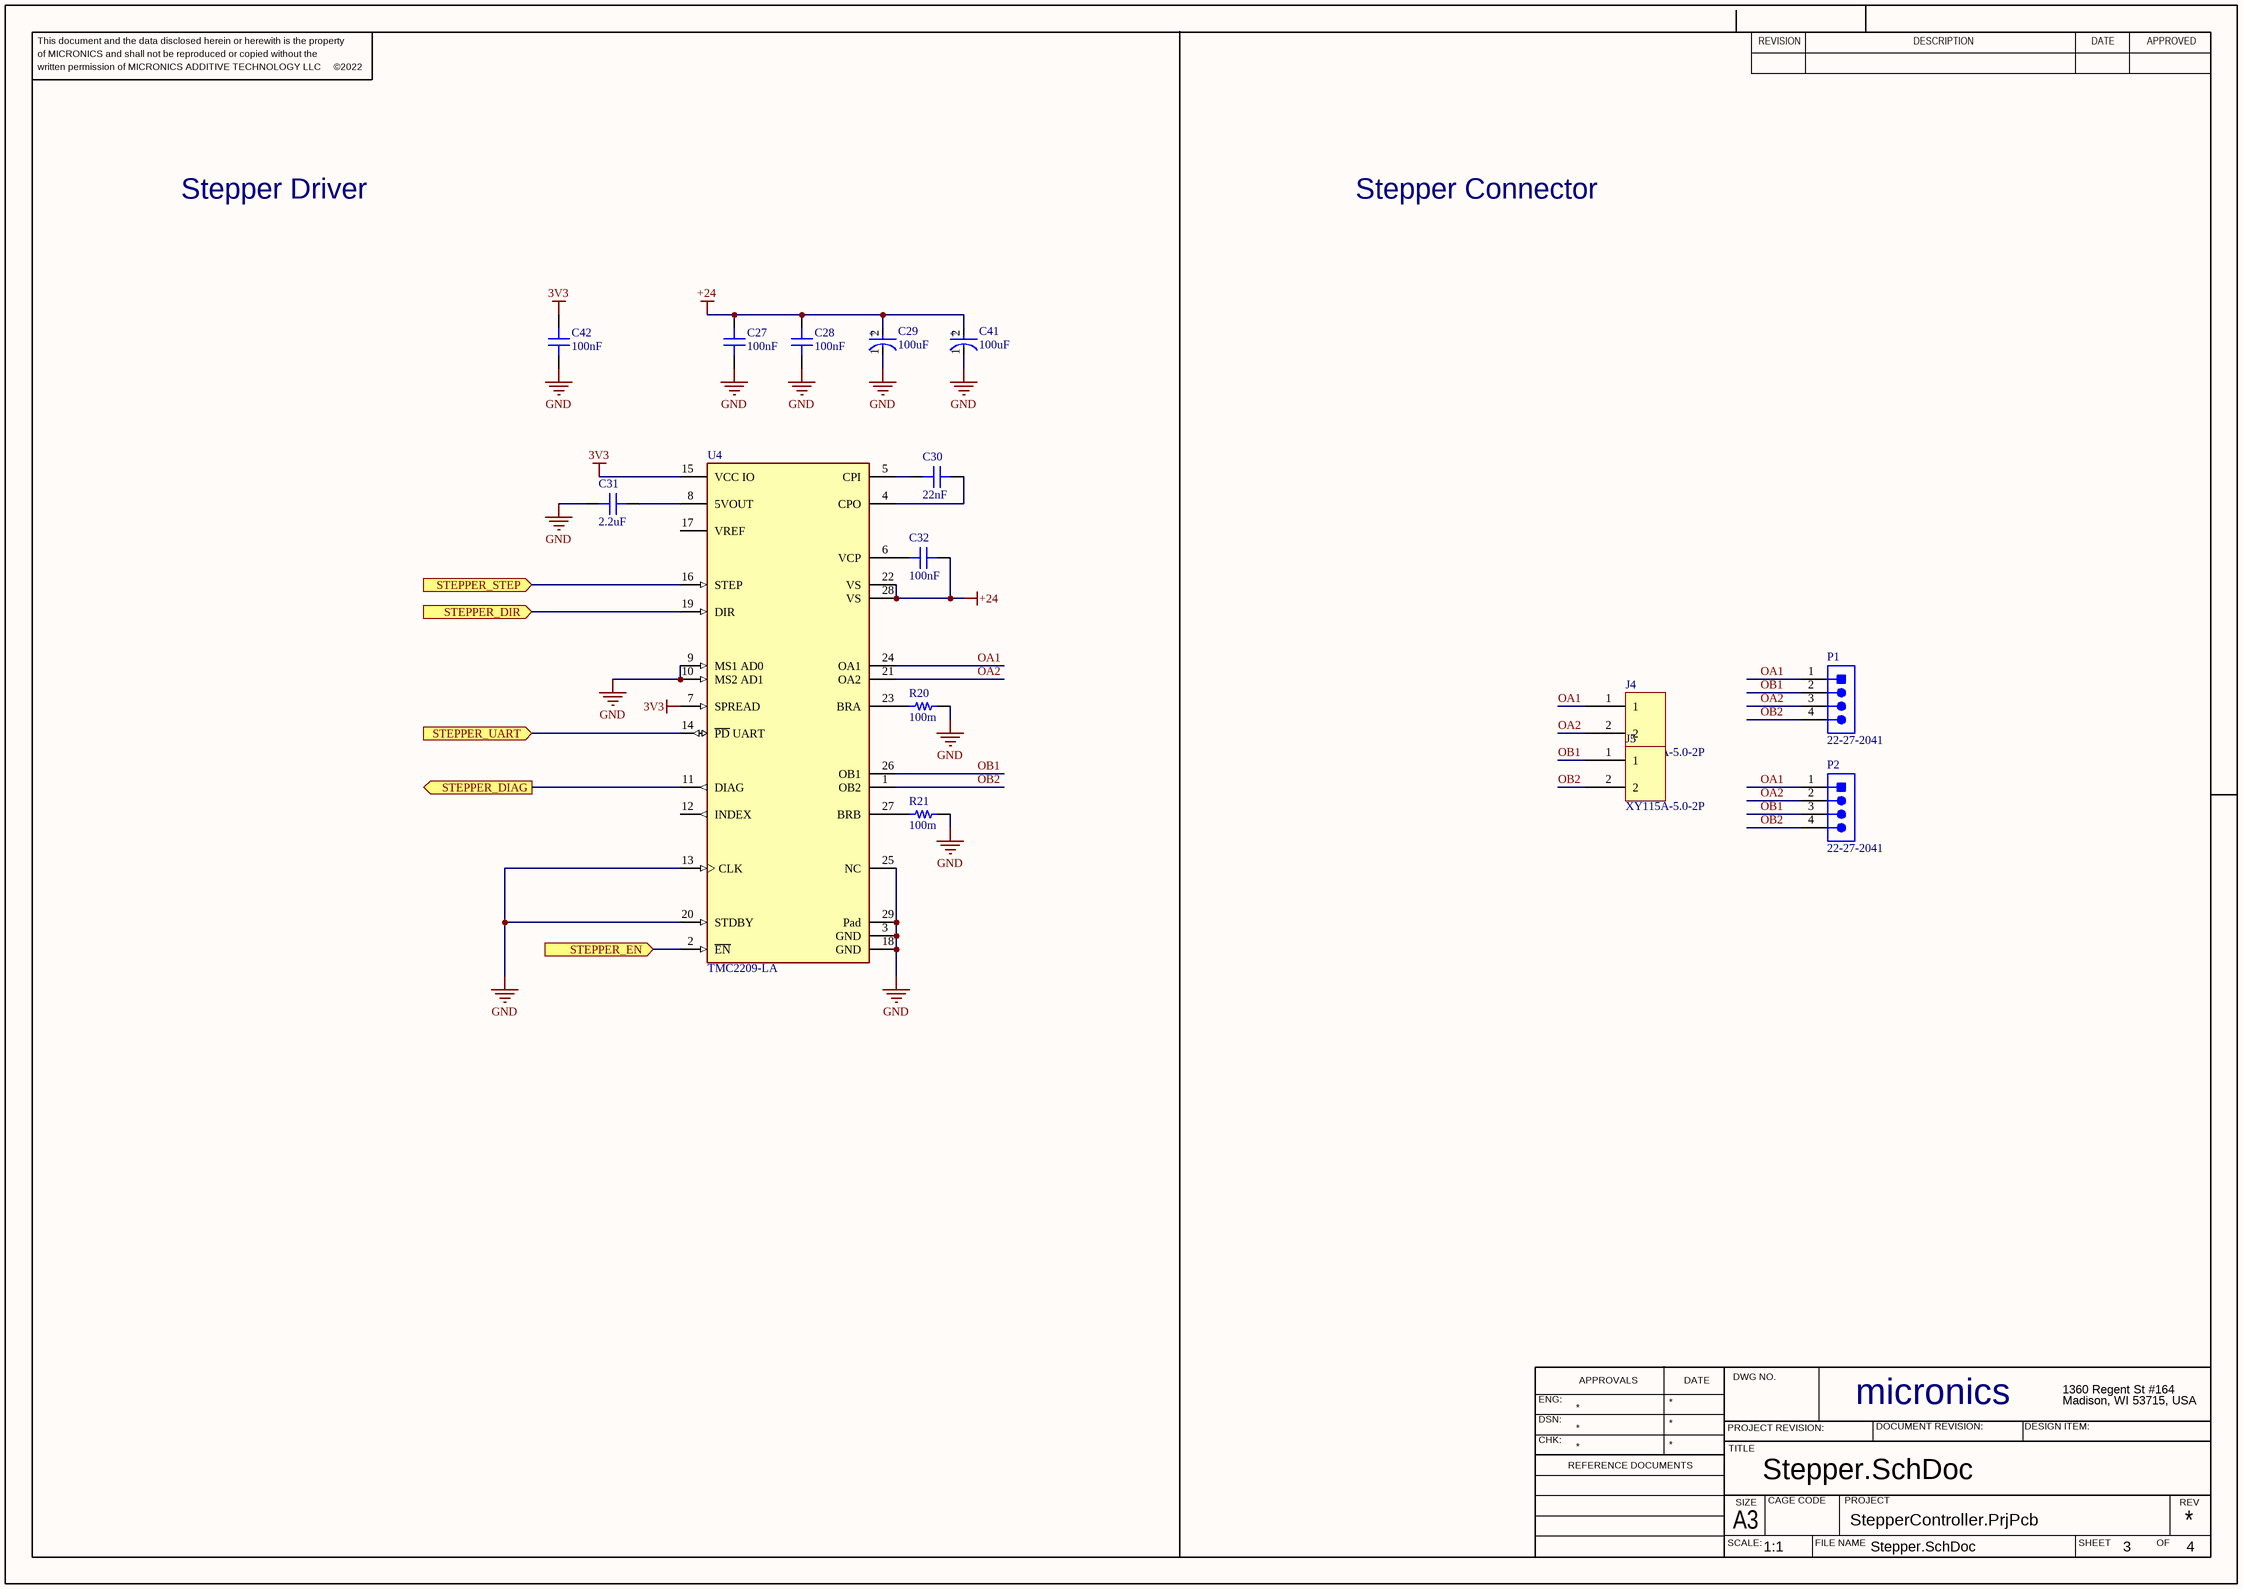
[diagram p2: Stepper.SchDoc]

### Parts
C27  100nF  [CAP 0603_1608]
C28  100nF  [CAP 0603_1608]
C29  100uF  [FP-SGV8X10_5-MFG]
C30  22nF  [CAP 0603_1608]
C31  2.2uF  [CAP 0603_1608]
C32  100nF  [CAP 0603_1608]
C41  100uF  [FP-SGV8X10_5-MFG]
C42  100nF  [CAP 0603_1608]
J4  XY115A-5.0-2P  [2.54-2PLTDK]
J5  XY115A-5.0-2P  [2.54-2PLTDK]
P1  22-27-2041  [MOLX-22-27-2041_V]
P2  22-27-2041  [MOLX-22-27-2041_V]
R20  100m  [RES 1206_3216]
R21  100m  [RES 1206_3216]
U4  TMC2209-LA  [FP-TMC2209-LA-IPC_C]

### Ports
STEPPER_DIAG (out, see ESP32[2A]), STEPPER_DIR (in, see ESP32[2A]), STEPPER_EN (in, see ESP32[2A]), STEPPER_STEP (in, see ESP32[2A]), STEPPER_UART (in, see ESP32[2A])

### Nets
3V3: C42.1 U4.7(SPREAD) U4.15(VCC_IO)
+24: C27.1 C28.1 C29.2(A) C32.1 C41.2(A) U4.22(VS) U4.28(VS)
GND: C27.2 C28.2 C29.1(C) C31.1 C41.1(C) C42.2 R20.2 R21.2 U4.3(GND) U4.9(MS1_AD0) U4.10(MS2_AD1) U4.13(CLK) U4.18(GND) U4.20(STDBY) U4.25(NC) U4.29(Pad)
OA1: J4.1 P1.1 P2.1 U4.24(OA1)
OA2: J4.2 P1.3 P2.2 U4.21(OA2)
OB1: J5.1 P1.2 P2.3 U4.26(OB1)
OB2: J5.2 P1.4 P2.4 U4.1(OB2)
NetC30_1: C30.1 U4.4(CPO)
NetC30_2: C30.2 U4.5(CPI)
NetC31_2: C31.2 U4.8(5VOUT)
NetC32_2: C32.2 U4.6(VCP)
NetIC1_8: U4.16(STEP) ; port STEPPER_STEP
NetIC1_9: U4.19(DIR) ; port STEPPER_DIR
NetIC1_10: U4.2(~{EN}) ; port STEPPER_EN
NetIC1_11: U4.14(~{PD}_UART) ; port STEPPER_UART
NetIC1_13: U4.11(DIAG) ; port STEPPER_DIAG
NetR20_1: R20.1 U4.23(BRA)
NetR21_1: R21.1 U4.27(BRB)

Not connected (* = marked no-connect by the designer): U4 12(INDEX) 17(VREF)

### Notes on the sheet
- Stepper Driver
- Stepper Connector
- This document and the data disclosed herein or herewith is the property
- of MICRONICS and shall not be reproduced or copied without the
- REVISION
- DESCRIPTION
- DATE
- APPROVED
- written permission of MICRONICS ADDITIVE TECHNOLOGY LLC     ©2022
- ENG:
- APPROVALS
- DWG NO.
- micronics
- 1360 Regent St #164
- Madison, WI 53715, USA
- DSN:
- CHK:
- REFERENCE DOCUMENTS
- PROJECT REVISION:
- TITLE
- DOCUMENT REVISION:
- DESIGN ITEM:
- SCALE:
- A3
- SIZE
- CAGE CODE
- FILE NAME
- PROJECT
- SHEET
- OF
- REV
- 1:1
- (in symbol CMP-35376-000016-1) +

### Library data of the parts
C27 C28 C32 C42 = 250X14W223MV4T: as C1 on sheet Power; Part Number: 250X14W223MV4T; Value: 100nF; Applications: Bypass, Decoupling; Capacitance: 100nF; componentlink1description: Datasheet; componentlink1url: https://www.johansondielectrics.com/downloads/x2y-filter-and-decoupling-capacitors.pdf; componentlink2description: DigiKey Link; componentlink2url: https://www.digikey.com/en/products/detail/johanson-dielectrics-inc/250X14W223MV4T/1628740; Device Package: 0603 (1608 Metric); Features: Low ESL (X2Y); lastupdated: 2022-05-16 11:25:57 AM; Lifecycle Status: Active; Minimum Order: 1; Mounting Type: Surface Mount, MLCC; Operating Temperature: -55°C ~ 125°C; Package / Case: 0603 (1608 Metric); packaging: TapeAndReel; partid: 14325; Part Status: Active; price: 0.07; series: X2Y®; Size / Dimension: 0.064" L x 0.035" W (1.63mm x 0.89mm); Supplier 1: DigiKey; Supplier Part Number 1: 709-1087-1-ND; Thickness (Max): 0.026" (0.66mm)
C29 C41 = CMP-35376-000016-1: C445063; Voltage Rating: 50V; Life (Hours): 2000Hour; Tolerance: 20%; Ripple Current: 230mA; Leakage Current: 3uA; Lead Diameter: 1.1mm; Min Operating Temperature: -55°C; Mount: Surface Mount; Series: SGV; Case/Package: Radial; RoHS Compliant: Yes; Package Quantity: 500; Max Operating Temperature: 105°C; Height: 10.5mm; Packaging: Tape and Reel; Construction: Cylindrical; Voltage: 50V; Diameter: 8mm; Lead Pitch: 3.1mm; Termination: SMD/SMT; Height - Seated (Max): 0.413inch; Lead Free: Lead Free; Capacitance: 100uF; Radiation Hardening: No
C30 = 250X14W223MV4T: C21122; manufacturer: Johanson Dielectrics Inc.; Temperature Coefficient: X7R; Tolerance: ±20%; Voltage - Rated: 25V; Part Number: 250X14W223MV4T; Value: 22nF; Applications: Bypass, Decoupling; Capacitance: 22nF; componentlink1description: Datasheet; componentlink1url: https://www.johansondielectrics.com/downloads/x2y-filter-and-decoupling-capacitors.pdf; componentlink2description: DigiKey Link; componentlink2url: https://www.digikey.com/en/products/detail/johanson-dielectrics-inc/250X14W223MV4T/1628740; Device Package: 0603 (1608 Metric); Features: Low ESL (X2Y); lastupdated: 2022-05-20 2:39:33 PM; Lifecycle Status: Active; Minimum Order: 1; Mounting Type: Surface Mount, MLCC; Operating Temperature: -55°C ~ 125°C; Package / Case: 0603 (1608 Metric); packaging: TapeAndReel; partid: 14325; Part Status: Active; price: 0.07; series: X2Y®; Size / Dimension: 0.064" L x 0.035" W (1.63mm x 0.89mm); Supplier 1: DigiKey; Supplier Part Number 1: 709-1087-1-ND; Thickness (Max): 0.026" (0.66mm)
C31 = 250X14W223MV4T: C23630; manufacturer: Johanson Dielectrics Inc.; Temperature Coefficient: X7R; Tolerance: ±20%; Voltage - Rated: 25V; Part Number: 250X14W223MV4T; Value: 2.2uF; Applications: Bypass, Decoupling; Capacitance: 2.2uF; componentlink1description: Datasheet; componentlink1url: https://www.johansondielectrics.com/downloads/x2y-filter-and-decoupling-capacitors.pdf; componentlink2description: DigiKey Link; componentlink2url: https://www.digikey.com/en/products/detail/johanson-dielectrics-inc/250X14W223MV4T/1628740; Device Package: 0603 (1608 Metric); Features: Low ESL (X2Y); lastupdated: 2022-05-20 2:39:33 PM; Lifecycle Status: Active; Minimum Order: 1; Mounting Type: Surface Mount, MLCC; Operating Temperature: -55°C ~ 125°C; Package / Case: 0603 (1608 Metric); packaging: TapeAndReel; partid: 14325; Part Status: Active; price: 0.07; series: X2Y®; Size / Dimension: 0.064" L x 0.035" W (1.63mm x 0.89mm); Supplier 1: DigiKey; Supplier Part Number 1: 709-1087-1-ND; Thickness (Max): 0.026" (0.66mm)
J4 J5 = 2.54-2PLTDK: C784935
P1 P2 = CMP-2000-05243-1: C504991; Manufacturer: Molex; Voltage rating: 250V; Current rating: 4A; Datasheet Version: Rev. F, 06/2009; Operating temperature: 0degCto+75degC; Contact material: Tinplatedbrass; Manufacturer URL: http://www.molex.com/; Housing material: Nylon(UL94V-0); Datasheet URL: http://www.molex.com/pdm_docs/sd/022272041_sd.pdf
R20 R21 = KRL1632E-M-R012-F-T5: C25334; Manufacturer: Susumu; Power (Watts): 0.75W, 3/4W; Temperature Coefficient: ±50ppm/°C; Tolerance: ±1%; Part Number: KRL1632E-M-R012-F-T5; ComponentLink1Description: Datasheet; ComponentLink1URL: http://www.susumu.co.jp/common/pdf/n_catalog_partition09_en.pdf; ComponentLink2Description: DigiKey Link; ComponentLink2URL: https://www.digikey.com/en/products/detail/susumu/KRL1632E-M-R012-F-T5/3737997; Composition: Metal Foil; Device Package: 1206 (3216 Metric); Features: Automotive AEC-Q200, Current Sense; Height - Seated (Max): 0.028" (0.70mm); LastUpdated: 2024-02-09 8:54:46 PM; Lifecycle Status: Active; Minimum Order: 1; Number of Terminations: 2; Operating Temperature: -55°C ~ 155°C; Package / Case: 1206 (3216 Metric); Packaging: TapeAndReel; PartId: 26839; Part Status: Active; Price: 0.09; Ratings: AEC-Q200; Resistance: 100m; Series: KRL; Size / Dimension: 0.126" L x 0.063" W (3.20mm x 1.60mm); Supplier 1: DigiKey; Supplier Part Number 1: 408-1571-1-ND; Supplier Device Package: 1206; Value: 100m
U4 = CMP-237673-000004-1: C465949; Manufacturer: Trinamic; Nominal Supply Current: 7-7.5mA; Max Supply Voltage: 29V; Output Current: 2.8A; Standoff Height: 0mm; Motor Type: Stepper; Max Junction Temp: +125°C; Max Power Dissipation: 2.8W; Min Supply Voltage: 1.5V; Number Of Outputs: 1; RoHS: TRUE; ComponentLink2Description: Datasheet; Temperature: -40°C to +125°C; Ipc Land Pattern Name: QFN50P500X500X85-28; Lead Free: Yes; Device Class L1: Integrated Circuits (ICs); ComponentLink2URL: https://www.trinamic.com/fileadmin/assets/Products/ICs_Documents/TMC2209_Datasheet_V103.pdf; Device Class L2: Power Management ICs; Temperature Range Low: -40°C; Automotive: No; Manufacturer Part Number: TMC2209-LA; Category: IC; Height: 0.9mm; Package: 0; Device Class L3: Motor Drivers; Octopart: https://octopart.com/tmc2209-la-trinamic-105993617; Temperature Range High: +125°C

## Sheet Buttons.SchDoc
size 420 x 297 mm; SheetNumber: 4; SheetTotal: 4
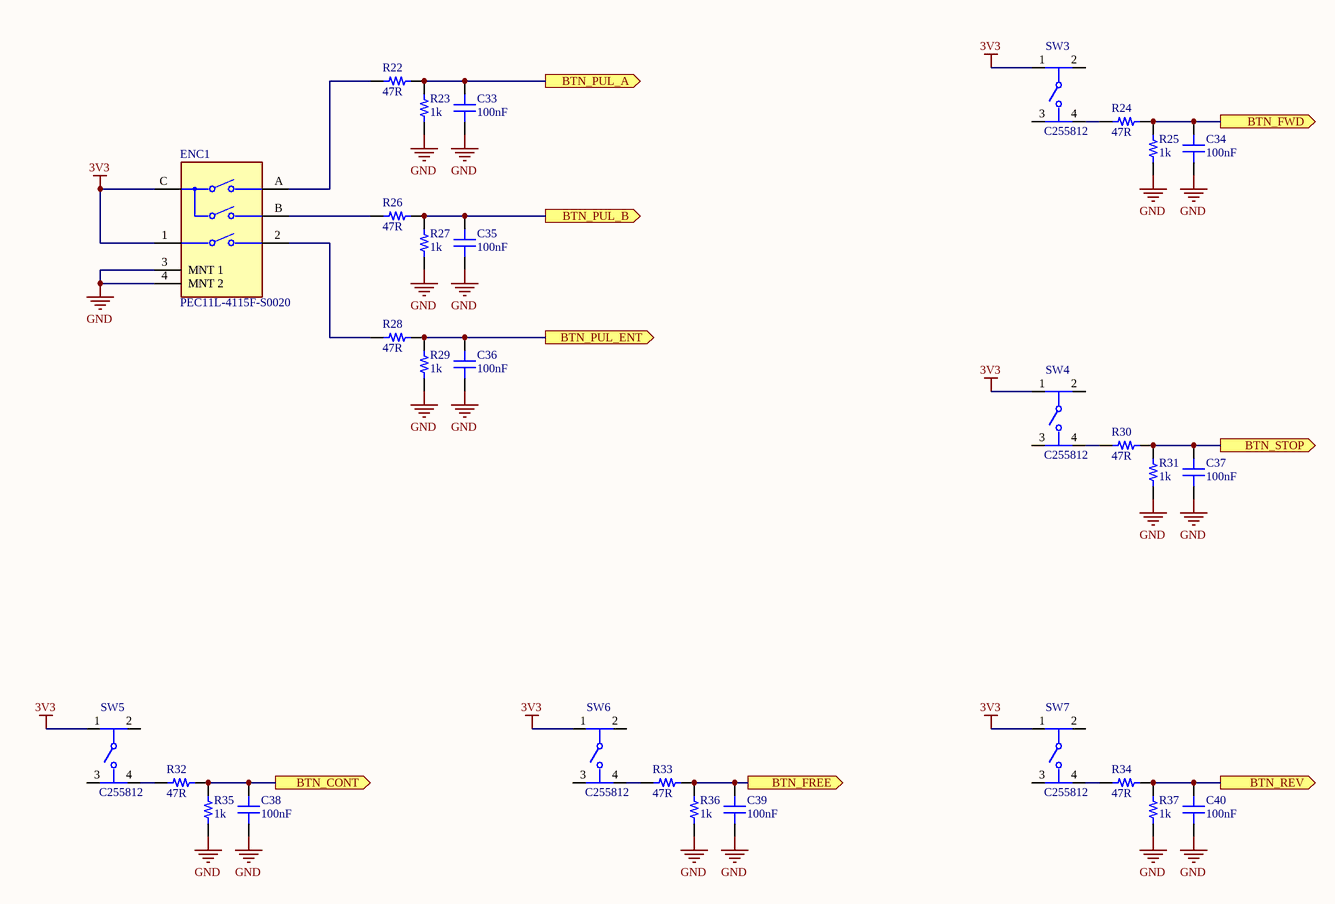
[diagram p3: Buttons.SchDoc]

### Parts
C33  100nF  [CAP 0603_1608]
C34  100nF  [CAP 0603_1608]
C35  100nF  [CAP 0603_1608]
C36  100nF  [CAP 0603_1608]
C37  100nF  [CAP 0603_1608]
C38  100nF  [CAP 0603_1608]
C39  100nF  [CAP 0603_1608]
C40  100nF  [CAP 0603_1608]
ENC1  PEC11L-4115F-S0020  [FP-PEC11L-4115F-S0020-MFG]
R22  47R  [RES 0603_1608]
R23  1k  [RES 0603_1608]
R24  47R  [RES 0603_1608]
R25  1k  [RES 0603_1608]
R26  47R  [RES 0603_1608]
R27  1k  [RES 0603_1608]
R28  47R  [RES 0603_1608]
R29  1k  [RES 0603_1608]
R30  47R  [RES 0603_1608]
R31  1k  [RES 0603_1608]
R32  47R  [RES 0603_1608]
R33  47R  [RES 0603_1608]
R34  47R  [RES 0603_1608]
R35  1k  [RES 0603_1608]
R36  1k  [RES 0603_1608]
R37  1k  [RES 0603_1608]
SW3  C255812  [FP-FSM2JSMAA-MFG]
SW4  C255812  [FP-FSM2JSMAA-MFG]
SW5  C255812  [FP-FSM2JSMAA-MFG]
SW6  C255812  [FP-FSM2JSMAA-MFG]
SW7  C255812  [FP-FSM2JSMAA-MFG]

### Ports
BTN_CONT (out, see ESP32[3A]), BTN_FREE (out, see ESP32[3A]), BTN_FWD (out, see ESP32[3A]), BTN_PUL_A (out, see ESP32[3A]), BTN_PUL_B (out, see ESP32[3A]), BTN_PUL_ENT (out, see ESP32[3A]), BTN_REV (out, see ESP32[3A]), BTN_STOP (out, see ESP32[3A])

### Nets
3V3: ENC1.1 ENC1.C(COMMON) SW3.1 SW4.1 SW5.1 SW6.1 SW7.1
GND: C33.2 C34.2 C35.2 C36.2 C37.2 C38.2 C39.2 C40.2 ENC1.3(MNT_1) ENC1.4(MNT_2) R23.2 R25.2 R27.2 R29.2 R31.2 R35.2 R36.2 R37.2
NetC33_1: C33.1 R22.2 R23.1 ; port BTN_PUL_A
NetC34_1: C34.1 R24.2 R25.1 ; port BTN_FWD
NetC35_1: C35.1 R26.2 R27.1 ; port BTN_PUL_B
NetC36_1: C36.1 R28.2 R29.1 ; port BTN_PUL_ENT
NetC37_1: C37.1 R30.2 R31.1 ; port BTN_STOP
NetC38_1: C38.1 R32.2 R35.1 ; port BTN_CONT
NetC39_1: C39.1 R33.2 R36.1 ; port BTN_FREE
NetC40_1: C40.1 R34.2 R37.1 ; port BTN_REV
NetENC1_2: ENC1.2 R28.1
NetENC1_A: ENC1.A(CHANNEL_A) R22.1
NetENC1_B: ENC1.B(CHANNEL_B) R26.1
NetR24_1: R24.1 SW3.4
NetR30_1: R30.1 SW4.4
NetR32_1: R32.1 SW5.4
NetR33_1: R33.1 SW6.4
NetR34_1: R34.1 SW7.4

Not connected (* = marked no-connect by the designer): SW3 2 3; SW4 2 3; SW5 2 3; SW6 2 3; SW7 2 3

### Notes on the sheet
- This document and the data disclosed herein or herewith is the property
- of MICRONICS and shall not be reproduced or copied without the
- REVISION
- DESCRIPTION
- DATE
- APPROVED
- written permission of MICRONICS ADDITIVE TECHNOLOGY LLC     ©2022
- ENG:
- APPROVALS
- DWG NO.
- micronics
- 1360 Regent St #164
- Madison, WI 53715, USA
- DSN:
- CHK:
- REFERENCE DOCUMENTS
- PROJECT REVISION:
- TITLE
- DOCUMENT REVISION:
- DESIGN ITEM:
- SCALE:
- A3
- SIZE
- CAGE CODE
- FILE NAME
- PROJECT
- SHEET
- OF
- REV
- 1:1

### Library data of the parts
C33-C40 = 250X14W223MV4T: as C1 on sheet Power; Part Number: 250X14W223MV4T; Value: 100nF; Applications: Bypass, Decoupling; Capacitance: 100nF; componentlink1description: Datasheet; componentlink1url: https://www.johansondielectrics.com/downloads/x2y-filter-and-decoupling-capacitors.pdf; componentlink2description: DigiKey Link; componentlink2url: https://www.digikey.com/en/products/detail/johanson-dielectrics-inc/250X14W223MV4T/1628740; Device Package: 0603 (1608 Metric); Features: Low ESL (X2Y); lastupdated: 2022-05-16 11:25:57 AM; Lifecycle Status: Active; Minimum Order: 1; Mounting Type: Surface Mount, MLCC; Operating Temperature: -55°C ~ 125°C; Package / Case: 0603 (1608 Metric); packaging: TapeAndReel; partid: 14325; Part Status: Active; price: 0.07; series: X2Y®; Size / Dimension: 0.064" L x 0.035" W (1.63mm x 0.89mm); Supplier 1: DigiKey; Supplier Part Number 1: 709-1087-1-ND; Thickness (Max): 0.026" (0.66mm)
ENC1 = CMP-07421-000053-1: ROTARY ENCODER MECHANICAL 20PPR; Output Type: Quadrature; Built in Switch: Yes; Pulses per Revolution: 20; Number of Channels: 2; Series: PEC11; Orientation: Vertical; Packaging: Bulk; Termination: PC Pin; Width: 11.8mm; Detent: Yes; Mount: Through Hole; RoHS Compliant: Yes; Min Operating Temperature: -25°C; Encoder Type: Mechanical; Package Quantity: 75; Max Operating Temperature: 80°C; Length: 19.5mm; Height: 12mm
R22-R37 = RNCF0603DTE23K2: as R7 on sheet ESP32; Part Number: RNCF0603DTE23K2; ComponentLink1Description: Datasheet; ComponentLink1URL: https://www.seielect.com/catalog/sei-rncf.pdf; ComponentLink2Description: DigiKey Link; ComponentLink2URL: https://www.digikey.com/en/products/detail/stackpole-electronics-inc/RNCF0603DTE23K2/6264115; Composition: Thin Film; Device Package: 0603 (1608 Metric); Features: Automotive AEC-Q200; Height - Seated (Max): 0.022" (0.55mm); LastUpdated: 2022-05-20 3:01:33 PM; Lifecycle Status: Active; Minimum Order: 1; Number of Terminations: 2; Operating Temperature: -55°C ~ 155°C; Package / Case: 0603 (1608 Metric); Packaging: TapeAndReel; PartId: 5426; Part Status: Active; Price: 0.01; Ratings: AEC-Q200; Series: RNCF; Size / Dimension: 0.061" L x 0.031" W (1.55mm x 0.80mm); Supplier 1: DigiKey; Supplier Part Number 1: RNCF0603DTE23K2CT-ND; Supplier Device Package: 0603
  R22 R24 R26 R28 R30 R32-R34: Value: 47R; Resistance: 47R
  R23 R25 R27 R29 R31 R35-R37: Value: 1k; Resistance: 1k
SW3-SW7 = CMP-03402-000003-1: as SW1 on sheet ESP32; Package: 0; Temperature Range High: +85°C; Temperature: -35°C to +85°C; Category: Switch; RoHS: TRUE; Mouser Description: Tactile Switches TACTILE 260G FORCE S; Device Class L1: Electromechanical; Mount: Surface Mount; Height: 4.59mm; ComponentLink2URL: https://www.te.com/commerce/DocumentDelivery/DDEController?Action=showdoc&DocId=Customer+Drawing%7F2-1437565-7%7FV%7Fpdf%7FEnglish%7FENG_CD_2-1437565-7_V.pdf%7F2-1437565-8; Temperature Range Low: -35°C; Voltage Rating Dc: 24V; Lead Free: Yes; Automotive: No; Throw Configuration: SPST-NO; Octopart: https://octopart.com/fsm2jsmaa-te+connectivity-41720620; Device Class L2: Switches; Device Class L3: Pushbutton Switches; ComponentLink2Description: Datasheet; Digikey Description: SWITCH TACTILE SPST-NO 0.05A 24V

## Nets that join several sheets
3V3: Power (6 pins), ESP32 (13 pins), Stepper (C42.1 U4.7 U4.15), Buttons (7 pins)
+12: Power (C5.1 C6.1 R3.2 U2.4), ESP32 (C23.2 C24.1 J2.2)
+24: Power (7 pins), Stepper (7 pins)
GND: Power (18 pins), ESP32 (50 pins), Stepper (16 pins), Buttons (18 pins)
NetC33_1: ESP32 (IC1.28), Buttons (C33.1 R22.2 R23.1)
NetC34_1: ESP32 (IC1.31), Buttons (C34.1 R24.2 R25.1)
NetC35_1: ESP32 (IC1.29), Buttons (C35.1 R26.2 R27.1)
NetC36_1: ESP32 (IC1.30), Buttons (C36.1 R28.2 R29.1)
NetC37_1: ESP32 (IC1.32), Buttons (C37.1 R30.2 R31.1)
NetC38_1: ESP32 (IC1.34), Buttons (C38.1 R32.2 R35.1)
NetC39_1: ESP32 (IC1.35), Buttons (C39.1 R33.2 R36.1)
NetC40_1: ESP32 (IC1.33), Buttons (C40.1 R34.2 R37.1)
NetIC1_8: ESP32 (IC1.8), Stepper (U4.16)
NetIC1_9: ESP32 (IC1.9), Stepper (U4.19)
NetIC1_10: ESP32 (IC1.10 R7.1), Stepper (U4.2)
NetIC1_11: ESP32 (IC1.11), Stepper (U4.14)
NetIC1_13: ESP32 (IC1.13), Stepper (U4.11)